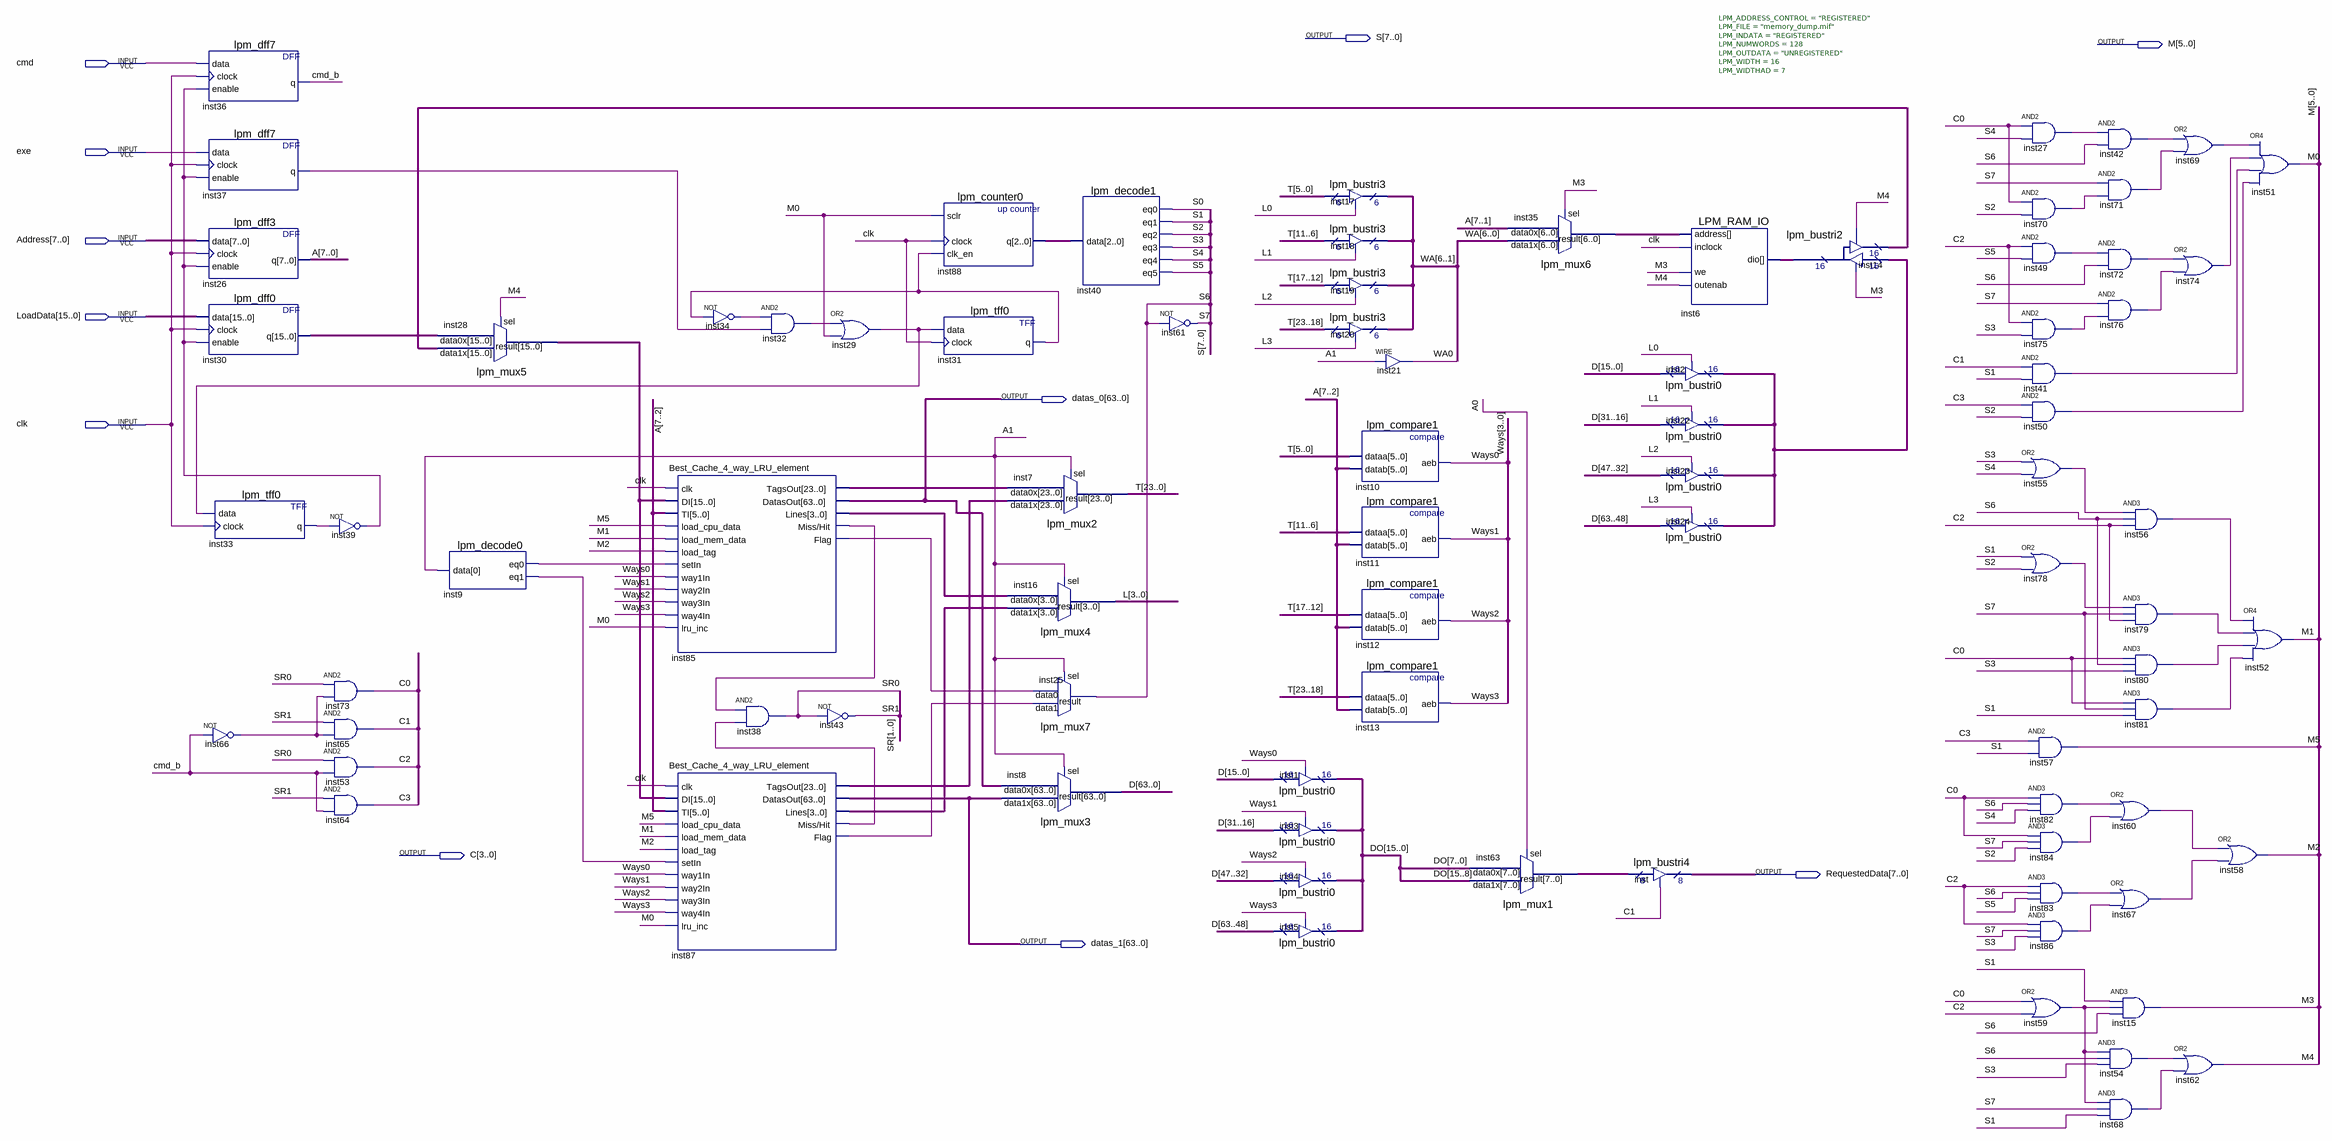
[diagram p0: schematic sheet]
// Quartus schematic Cache_4_way.bdf as structural Verilog: 83 symbols, 11 pins
module Cache_4_way (
  input  cmd,
  input  exe,
  input  [7:0] Address,
  input  [15:0] LoadData,
  input  clk,
  output [7:0] S,
  output [5:0] M,
  output [63:0] datas_0,
  output [3:0] C,
  output [7:0] RequestedData,
  output [63:0] datas_1
);

  wire cmd_b, inst9_eq0, inst9_eq1, inst27_out, inst29_out, inst31_q, inst32_out, inst33_q, inst34_out,
       inst37_q, inst39_out, inst41_out, inst42_out, inst49_out, inst50_out, inst54_out, inst55_out,
       inst56_out, inst59_out, inst60_out, inst66_out, inst67_out, inst68_out, inst69_out, inst70_out,
       inst71_out, inst72_out, inst74_out, inst75_out, inst76_out, inst78_out, inst79_out, inst80_out,
       inst81_out, inst82_out, inst83_out, inst84_out, inst85_flag, inst85_miss_hit, inst86_out, inst87_flag,
       inst87_miss_hit;
  wire [1:0] SR;
  wire [2:0] inst88_q;
  wire [3:0] inst85_lines, inst87_lines, L, Ways;
  wire [6:0] inst35_result, WA;
  wire [7:0] A, inst63_result;
  wire [15:0] DO, inst2_tridata, inst6_dio, inst14_result, inst28_result, inst30_q;
  wire [23:0] inst85_tagsout, inst87_tagsout, T;
  wire [63:0] D;

  lpm_dff7 inst36 (.data(cmd), .clock(clk), .enable(inst39_out), .q(cmd_b));
  lpm_dff7 inst37 (.data(exe), .clock(clk), .enable(inst39_out), .q(inst37_q));
  lpm_dff3 inst26 (.data(Address), .clock(clk), .enable(inst39_out), .q(A));
  lpm_dff0 inst30 (.data(LoadData), .clock(clk), .enable(inst39_out), .q(inst30_q));
  lpm_tff0 inst33 (.data(inst29_out), .clock(clk), .q(inst33_q));
  not inst66 (inst66_out, cmd_b);
  not inst39 (inst39_out, inst33_q);
  and inst73 (C[0], SR[0], inst66_out);
  and inst65 (C[1], SR[1], inst66_out);
  and inst53 (C[2], SR[0], cmd_b);
  and inst64 (C[3], SR[1], cmd_b);
  lpm_mux5 inst28 (.data1x(inst14_result), .data0x(inst30_q), .sel(M[4]), .result(inst28_result));
  lpm_decode0 inst9 (.data(A[1]), .eq0(inst9_eq0), .eq1(inst9_eq1));
  Best_Cache_4_way_LRU_element inst85 (
    .clk(clk), .DI(inst28_result), .TI(A[7:2]), .load_cpu_data(M[5]), .load_mem_data(M[1]), .load_tag(M[2]),
    .setIn(inst9_eq0), .way1In(Ways[0]), .way2In(Ways[1]), .way3In(Ways[2]), .way4In(Ways[3]),
    .lru_inc(M[0]), .TagsOut(inst85_tagsout), .DatasOut(datas_0), .Lines(inst85_lines),
    .\Miss/Hit (inst85_miss_hit), .Flag(inst85_flag));
  Best_Cache_4_way_LRU_element inst87 (
    .clk(clk), .DI(inst28_result), .TI(A[7:2]), .load_cpu_data(M[5]), .load_mem_data(M[1]), .load_tag(M[2]),
    .setIn(inst9_eq1), .way1In(Ways[0]), .way2In(Ways[1]), .way3In(Ways[2]), .way4In(Ways[3]),
    .lru_inc(M[0]), .TagsOut(inst87_tagsout), .DatasOut(datas_1), .Lines(inst87_lines),
    .\Miss/Hit (inst87_miss_hit), .Flag(inst87_flag));
  not inst34 (inst34_out, inst31_q);
  and inst32 (inst32_out, inst34_out, inst37_q);
  and inst38 (SR[0], inst85_miss_hit, inst87_miss_hit);
  not inst43 (SR[1], SR[0]);
  or inst29 (inst29_out, inst32_out, M[0]);
  lpm_counter0 inst88 (.sclr(M[0]), .clock(clk), .clk_en(inst31_q), .q(inst88_q));
  lpm_tff0 inst31 (.data(inst29_out), .clock(clk), .q(inst31_q));
  lpm_mux2 inst7 (.data1x(inst87_tagsout), .data0x(inst85_tagsout), .sel(A[1]), .result(T));
  lpm_mux4 inst16 (.data1x(inst87_lines), .data0x(inst85_lines), .sel(A[1]), .result(L));
  lpm_mux3 inst8 (.data1x(datas_1), .data0x(datas_0), .sel(A[1]), .result(D));
  lpm_decode1 inst40 (.data(inst88_q), .eq0(S[0]), .eq1(S[1]), .eq2(S[2]), .eq3(S[3]), .eq4(S[4]), .eq5(S[5]));
  lpm_mux7 inst25 (.data1(inst87_flag), .data0(inst85_flag), .sel(A[1]), .result(S[6]));
  not inst61 (S[7], S[6]);
  lpm_bustri0 inst1 (.enabledt(Ways[0]), .data(D[15:0]), .tridata(DO));
  lpm_bustri0 inst3 (.enabledt(Ways[1]), .data(D[31:16]), .tridata(DO));
  lpm_bustri0 inst4 (.enabledt(Ways[2]), .data(D[47:32]), .tridata(DO));
  lpm_bustri0 inst5 (.enabledt(Ways[3]), .data(D[63:48]), .tridata(DO));
  lpm_bustri3 inst17 (.enabledt(L[0]), .data(T[5:0]), .tridata(WA[6:1]));
  lpm_bustri3 inst18 (.enabledt(L[1]), .data(T[11:6]), .tridata(WA[6:1]));
  lpm_bustri3 inst19 (.enabledt(L[2]), .data(T[17:12]), .tridata(WA[6:1]));
  lpm_bustri3 inst20 (.enabledt(L[3]), .data(T[23:18]), .tridata(WA[6:1]));
  assign WA[0] = A[1];  // WIRE inst21
  lpm_compare1 inst10 (.dataa(T[5:0]), .datab(A[7:2]), .aeb(Ways[0]));
  lpm_compare1 inst11 (.dataa(T[11:6]), .datab(A[7:2]), .aeb(Ways[1]));
  lpm_compare1 inst12 (.dataa(T[17:12]), .datab(A[7:2]), .aeb(Ways[2]));
  lpm_compare1 inst13 (.dataa(T[23:18]), .datab(A[7:2]), .aeb(Ways[3]));
  lpm_mux1 inst63 (.data1x(DO[15:8]), .data0x(DO[7:0]), .sel(A[0]), .result(inst63_result));
  lpm_mux6 inst35 (.data1x(WA), .data0x(A[7:1]), .sel(M[3]), .result(inst35_result));
  lpm_bustri4 inst (.enabledt(C[1]), .data(inst63_result), .tridata(RequestedData));
  LPM_RAM_IO #(.LPM_ADDRESS_CONTROL("REGISTERED"), .LPM_FILE("memory_dump.mif"), .LPM_INDATA("REGISTERED"), .LPM_NUMWORDS(128), .LPM_OUTDATA("UNREGISTERED"), .LPM_WIDTH(16), .LPM_WIDTHAD(7)) inst6 (
    .address(inst35_result), .inclock(clk), .we(M[3]), .outenab(M[4]), .dio(inst6_dio));
  lpm_bustri0 inst2 (.enabledt(L[0]), .data(D[15:0]), .tridata(inst2_tridata));
  lpm_bustri0 inst22 (.enabledt(L[1]), .data(D[31:16]), .tridata(inst2_tridata));
  lpm_bustri0 inst23 (.enabledt(L[2]), .data(D[47:32]), .tridata(inst2_tridata));
  lpm_bustri0 inst24 (.enabledt(L[3]), .data(D[63:48]), .tridata(inst2_tridata));
  lpm_bustri2 inst14 (
    .enabledt(M[3]), .data(inst2_tridata), .enabletr(M[4]), .result(inst14_result), .tridata(inst6_dio));
  and inst27 (inst27_out, C[0], S[4]);
  and inst70 (inst70_out, C[0], S[2]);
  and inst49 (inst49_out, C[2], S[5]);
  and inst75 (inst75_out, C[2], S[3]);
  and inst41 (inst41_out, C[1], S[1]);
  and inst50 (inst50_out, C[3], S[2]);
  or inst55 (inst55_out, S[3], S[4]);
  or inst78 (inst78_out, S[1], S[2]);
  and inst57 (M[5], C[3], S[1]);
  and inst82 (inst82_out, C[0], S[6], S[4]);
  and inst84 (inst84_out, C[0], S[7], S[2]);
  and inst83 (inst83_out, C[2], S[6], S[5]);
  and inst86 (inst86_out, C[2], S[7], S[3]);
  or inst59 (inst59_out, C[0], C[2]);
  and inst42 (inst42_out, inst27_out, S[6]);
  and inst71 (inst71_out, S[7], inst70_out);
  and inst72 (inst72_out, inst49_out, S[6]);
  and inst76 (inst76_out, S[7], inst75_out);
  and inst56 (inst56_out, inst55_out, S[6], C[2]);
  and inst79 (inst79_out, inst78_out, S[7], C[2]);
  and inst80 (inst80_out, C[0], S[6], S[3]);
  and inst81 (inst81_out, C[0], S[7], S[1]);
  or inst60 (inst60_out, inst82_out, inst84_out);
  or inst67 (inst67_out, inst83_out, inst86_out);
  and inst15 (M[3], S[1], inst59_out, S[6]);
  and inst54 (inst54_out, inst59_out, S[6], S[3]);
  and inst68 (inst68_out, inst59_out, S[7], S[1]);
  or inst69 (inst69_out, inst42_out, inst71_out);
  or inst74 (inst74_out, inst72_out, inst76_out);
  or inst62 (M[4], inst54_out, inst68_out);
  or inst58 (M[2], inst60_out, inst67_out);
  or inst51 (M[0], inst69_out, inst74_out, inst41_out, inst50_out);
  or inst52 (M[1], inst56_out, inst79_out, inst80_out, inst81_out);
endmodule
